# EAGLE design Power_grad2 (EAGLE 9.5.2)
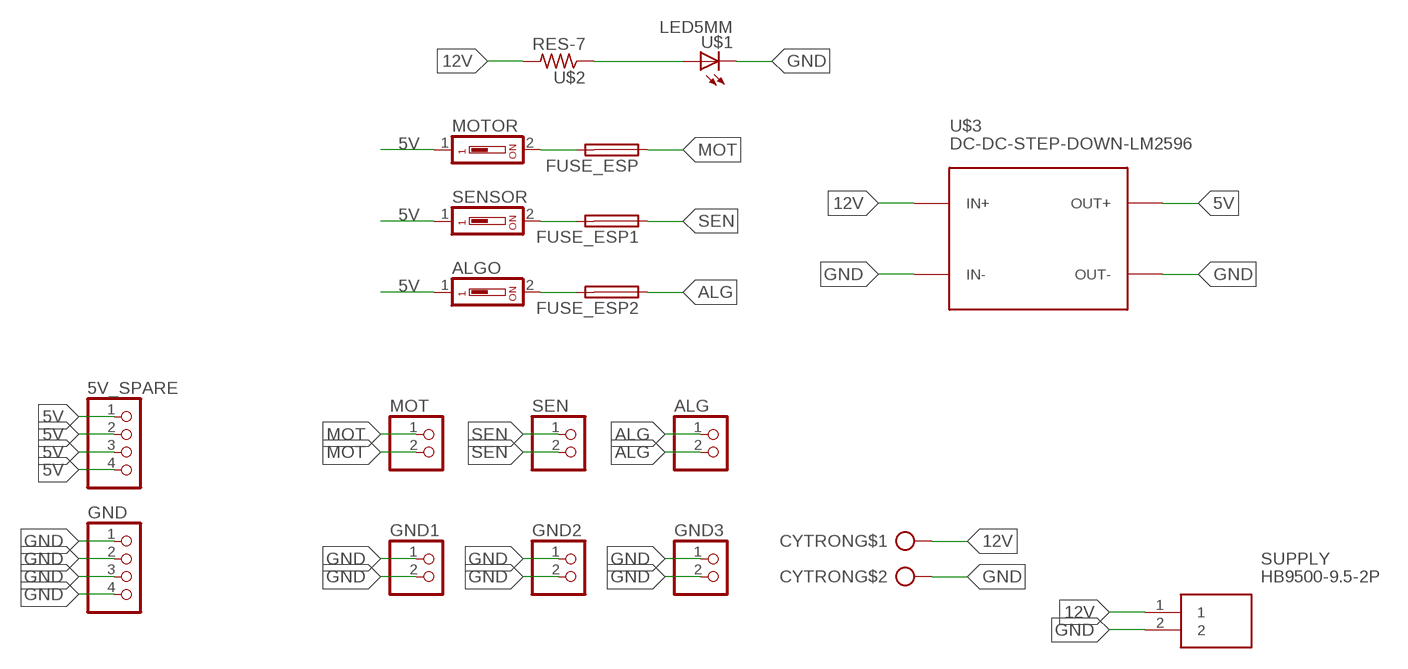
[diagram p0: schematic, sheet 1]

## Parts
5V_SPARE  PINHD-1X4  [1X04]
ALG  PINHD-2_DATA  [1X02_DATA]
ALGO  DS01  [DS-01]
CYTRON  CON_PTR_2  [AK300/2]
FUSE_ESP  FUSE_HOLDER  [SH22,5A]
FUSE_ESP1  FUSE_HOLDER  [SH22,5A]
FUSE_ESP2  FUSE_HOLDER  [SH22,5A]
GND  PINHD-1X4  [1X04]
GND1  PINHD-2_DATA  [1X02_DATA]
GND2  PINHD-2_DATA  [1X02_DATA]
GND3  PINHD-2_DATA  [1X02_DATA]
MOT  PINHD-2_DATA  [1X02_DATA]
MOTOR  DS01  [DS-01]
SEN  PINHD-2_DATA  [1X02_DATA]
SENSOR  DS01  [DS-01]
SUPPLY  HB9500-9.5-2P  [SHDR2W140P0X950_1X2_2055X1800X]
U$1  LED5MM  [LED5MM]
U$2  RES-7  [0204/7]
U$3  DC-DC-STEP-DOWN-LM2596  [DC-DC-STEP-DOWN-LM2596]

## Nets
5V: 5V_SPARE.1 5V_SPARE.2 5V_SPARE.3 5V_SPARE.4 ALGO.1 MOTOR.1 SENSOR.1 U$3.OUT+
12V: CYTRON.1 SUPPLY.1 U$2.2 U$3.IN+
ALG: ALG.1 ALG.2 FUSE_ESP2.1
GND: CYTRON.2 GND1.1 GND1.2 GND2.1 GND2.2 GND3.1 GND3.2 GND.1 GND.2 GND.3 GND.4 SUPPLY.2 U$1.K(C) U$3.IN- U$3.OUT-
MOT: FUSE_ESP.1 MOT.1 MOT.2
N$1: U$1.A U$2.1
N$2: FUSE_ESP1.2 SENSOR.2
N$3: FUSE_ESP.2 MOTOR.2
N$4: ALGO.2 FUSE_ESP2.2
SEN: FUSE_ESP1.1 SEN.1 SEN.2

## Library data of the parts
5V_SPARE GND = ALL:PINHD-1X4: PIN HEADER
ALG GND1-GND3 MOT SEN = ALL:PINHD-2_DATA: PIN HEADER
ALGO MOTOR SENSOR = ALL:DS01: DIL/CODE SWITCH; OC_FARNELL: unknown; OC_NEWARK: unknown
CYTRON = ALL:CON_PTR_2
FUSE_ESP FUSE_ESP1 FUSE_ESP2 = ALL:FUSE_HOLDER
SUPPLY = HB9500-9.5-2P:HB9500-9.5-2P: Barrier Block 2 2 0.374"(9.50mm) 12-22 AWG P=9.5mm Barrier Terminal Blocks Source: Datasheet <https://datasheet.lcsc.com/szlcsc/Ningbo-Kangnex-Elec-Ningbo-Kangnex-Elec-HB9500-2P-black_C60785.pdf>; DESCRIPTION: Barrier Block 2 2 0.374"(9.50mm) 12-22 AWG P=9.5mm Barrier Terminal Blocks; HEIGHT: 14.4mm; MANUFACTURER_NAME: Ningbo Kangnex; MANUFACTURER_PART_NUMBER: HB9500-9.5-2P
U$1 = ALL:LED5MM
U$2 = ALL:RES-7
U$3 = ALL:DC-DC-STEP-DOWN-LM2596: DC/DC Step-Down Regulator based on LM2596-ADJ chip LM2596 datasheet available here: http://www.ti.com/lit/ds/symlink/lm2596.pdf Click here to find device on ebay.com <http://www.ebay.com/sch/lm2596+power+regulator>

## Board
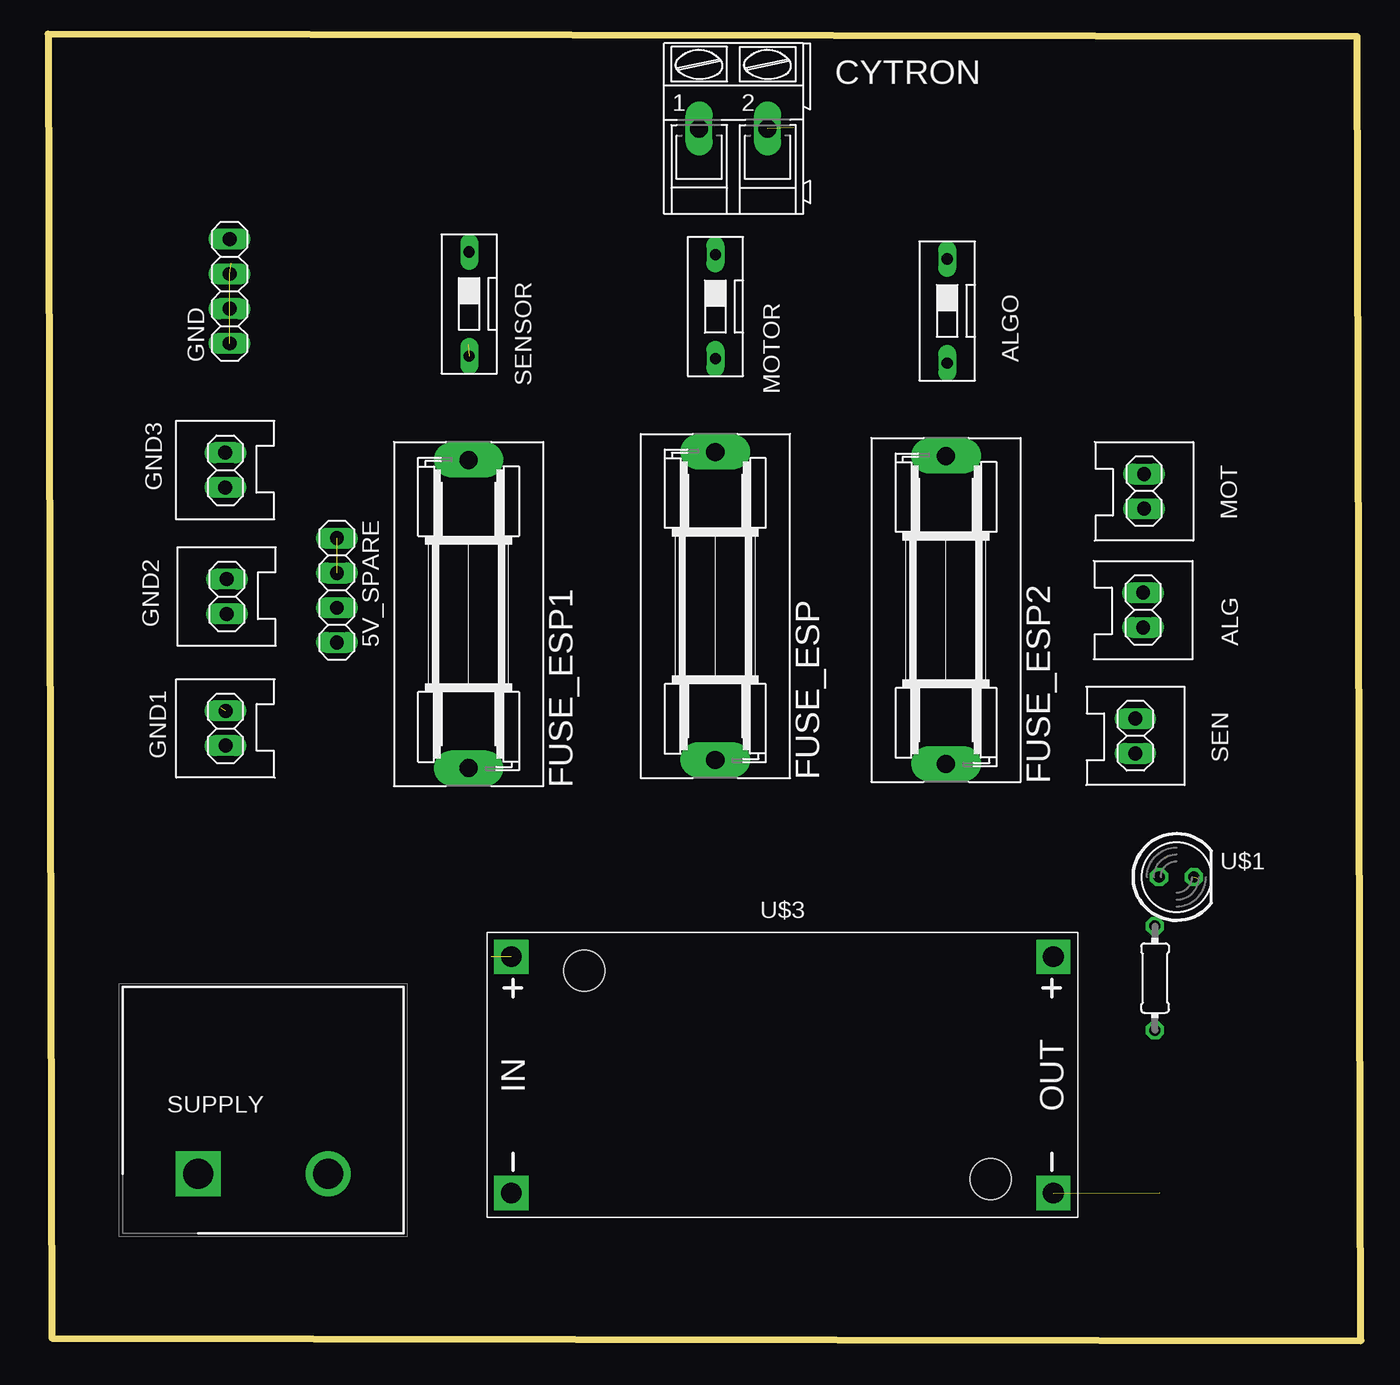
[diagram p1: board, top side]
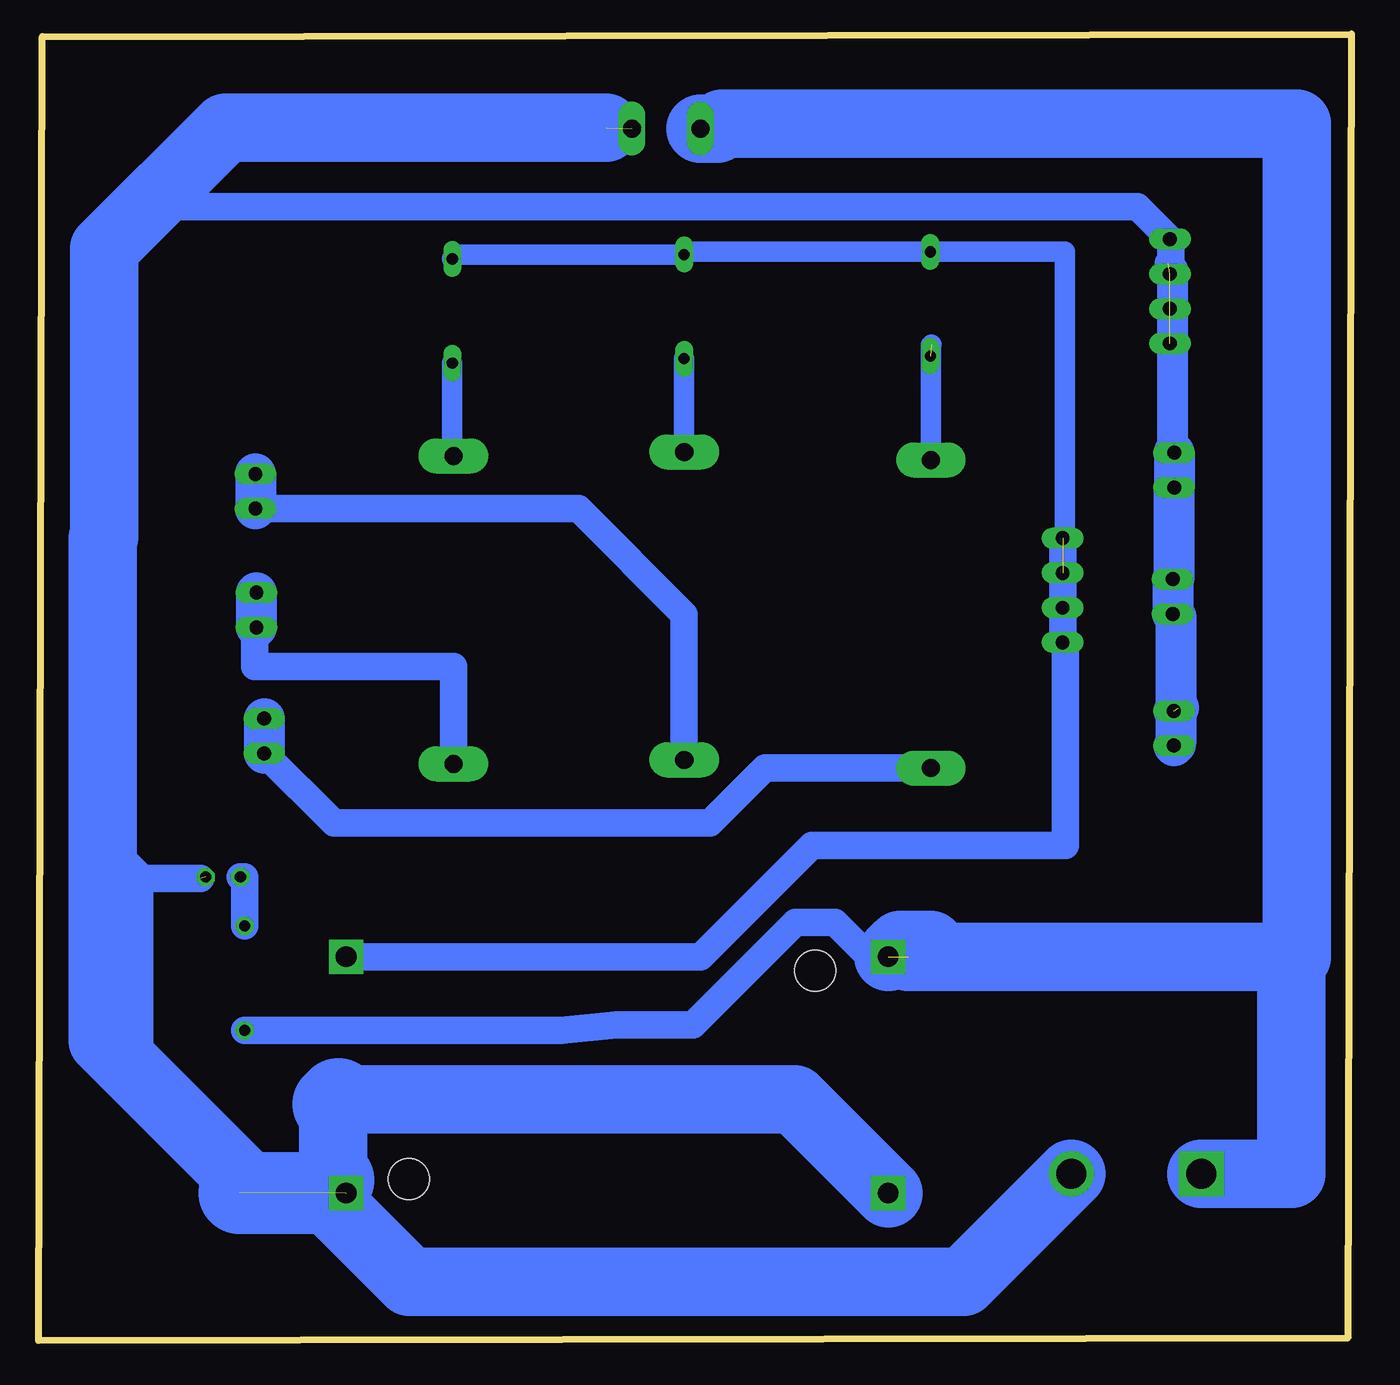
[diagram p2: board, bottom side, seen from below]

Size 95.95 x 95.49 mm. Coordinates in mm from the lower left corner, seen from the top.
Outline: 0.27,0.18 95.95,0 95.68,95.31 0,95.49 0.27,0.18
Copper layers (1*16): Top 0.035mm / dielectric 1.5mm / Bottom 0.035mm
Design rules "default *": minimum track width 6mil, minimum drill 0.35mm, track to track 0.8mm, track to pad 0.8mm, pad to pad 6mil, via to via 6mil, smd to smd 6mil, copper to edge 40mil, drill to drill 6mil, minimum pad ring 10mil, minimum via ring 8mil, stop-mask expansion 4mil, vias tented up to drill 0mil, thermal gap 10mil

### Footprints (pad centres in the part's own frame; a part is rotated, then mirrored left to right if it is on the bottom)
1X04 = drill 1.016 long: 1 -3.81,0; 2 -1.27,0; 3 1.27,0; 4 3.81,0
1X02_DATA = drill 1.016 long: 1 -1.27,0; 2 1.27,0
DS-01 = drill 0.813 long: 1 0,-3.81; 2 0,3.81
AK300/2 = drill 1.321 long: 1 -2.515,0; 2 2.489,0
SH22,5A = drill 1.321 pad 2.54 long: 1 -11.252,0; 2 11.252,0
SHDR2W140P0X950_1X2_2055X1800X = drill 2.2 pad 3.3 square: 1 0,0 | drill 2.2 pad 3.3: 2 9.5,0
LED5MM = drill 0.813 octagon: A -1.27,0; K 1.27,0
0204/7 = drill 0.813 octagon: 1 -3.81,0; 2 3.81,0
DC-DC-STEP-DOWN-LM2596 = drill 1.5 pad 2.5 square: IN+ -19.812,8.636; IN- -19.812,-8.636; OUT+ 19.812,8.636; OUT- 19.812,-8.636 | hole 3: -14.478,7.62; 15.24,-7.62

### Placement (x,y rotation side)
5V_SPARE  21.1,54.84 270 top
ALG  80.03,53.4 270 top
ALGO  65.71,75.26 180 top
CYTRON  50.1,88.59 0 top
FUSE_ESP  48.76,53.7 90 top
FUSE_ESP1  30.73,53.11 90 top
FUSE_ESP2  65.63,53.41 90 top
GND  13.26,76.7 90 top
GND1  12.96,44.76 90 top
GND2  13.06,54.39 90 top
GND3  12.95,63.63 90 top
MOT  80.1,62.08 270 top
MOTOR  48.77,75.58 180 top
SEN  79.46,44.2 270 top
SENSOR  30.77,75.77 180 top
SUPPLY  10.96,12.2 0 top
U$1  82.47,33.89 0 top
U$2  80.9,26.5 270 top
U$3  53.66,19.42 0 top

### Tracks (layer width: path | path; a pad name or v marks a point on that pad's centre or on a via)
5V  (1 unrouted)
  Bottom 1.5: 5V_SPARE.4 20.95,51.18 20.95,79.58 SENSOR.1 48.58,79.58 MOTOR.1 65.39,79.39 ALGO.1
  Bottom 2: 5V_SPARE.1 5V_SPARE.3 5V_SPARE.4 20.89,50.82 20.89,36.2 39.41,36.2 47.56,28.06 U$3.OUT+
12V  (1 unrouted)
  Bottom 2: U$2.2 57.77,22.69 53.71,23.07 48.13,23.07 40.64,30.56 37.73,30.56 35.77,28.6 33.31,28.6 | U$3.IN+ 4.38,28.06
  Bottom 5: SUPPLY.1 4.38,12.2 4.38,28.06 | U$3.IN+ 33.31,28.6 32.97,28.94 30.77,28.94 | CYTRON.1 46.38,88.59 46.01,88.96 3.98,88.96 3.98,28.06 32.37,28.06
ALG
  Bottom 2: FUSE_ESP2.1 65.63,49.26 80.17,49.26 80.17,51.99 ALG.2
  Bottom 3: ALG.1 ALG.2
GND  (7 unrouted)
  Bottom 2: GND3.2 13.2,65.15 13.2,80.45 GND.4 15.62,82.88 88.06,82.88 82.29,88.65 | 13.38,78.75 12.95,78.31 GND3.1 | 90.38,35.8 88.38,33.8 84.11,33.8 | U$3.OUT- 73.48,10.79 81,10.79 88.55,18.34 88.55,33.8
  Bottom 3: GND1.2 12.84,45.91 12.84,43.61 GND1.1 | GND3.2 GND3.1 12.95,55.77 GND2.2 GND2.1 12.82,52.88 12.82,46.45 12.63,46.26
  Bottom 5: SUPPLY.2 28.37,4.29 68.83,4.29 75.34,10.8 | 74.05,17.64 40.71,17.64 U$3.IN- | 54.49,88.65 82.29,88.65 91.14,79.8 91.14,58.76 91.27,58.63 91.27,21.96 80.11,10.8 | 74.42,17.28 74.42,11.72
  Bottom 6: 74.05,17.64 74.42,17.28 | 74.42,11.72 75.34,10.8 80.11,10.8 81.26,10.8
MOT
  Bottom 2: FUSE_ESP.1 48.76,53.08 56.49,60.81 MOT.2
  Bottom 3: MOT.1 MOT.2
N$1
  Bottom 2: U$2.1 80.9,33.89 U$1.A
N$2  (1 unrouted)
  Bottom 1.5: FUSE_ESP1.2 30.73,72.78 30.71,72.8
N$3
  Bottom 1.5: MOTOR.2 48.77,64.96 FUSE_ESP.2
N$4
  Bottom 1.5: ALGO.2 65.71,64.74 FUSE_ESP2.2
SEN
  Bottom 2: FUSE_ESP1.1 42.85,41.86 46.89,37.83 74.35,37.83 SEN.2
  Bottom 3: SEN.1 SEN.2